# Altium schematic sheet K210_V1.SchDoc
size A2
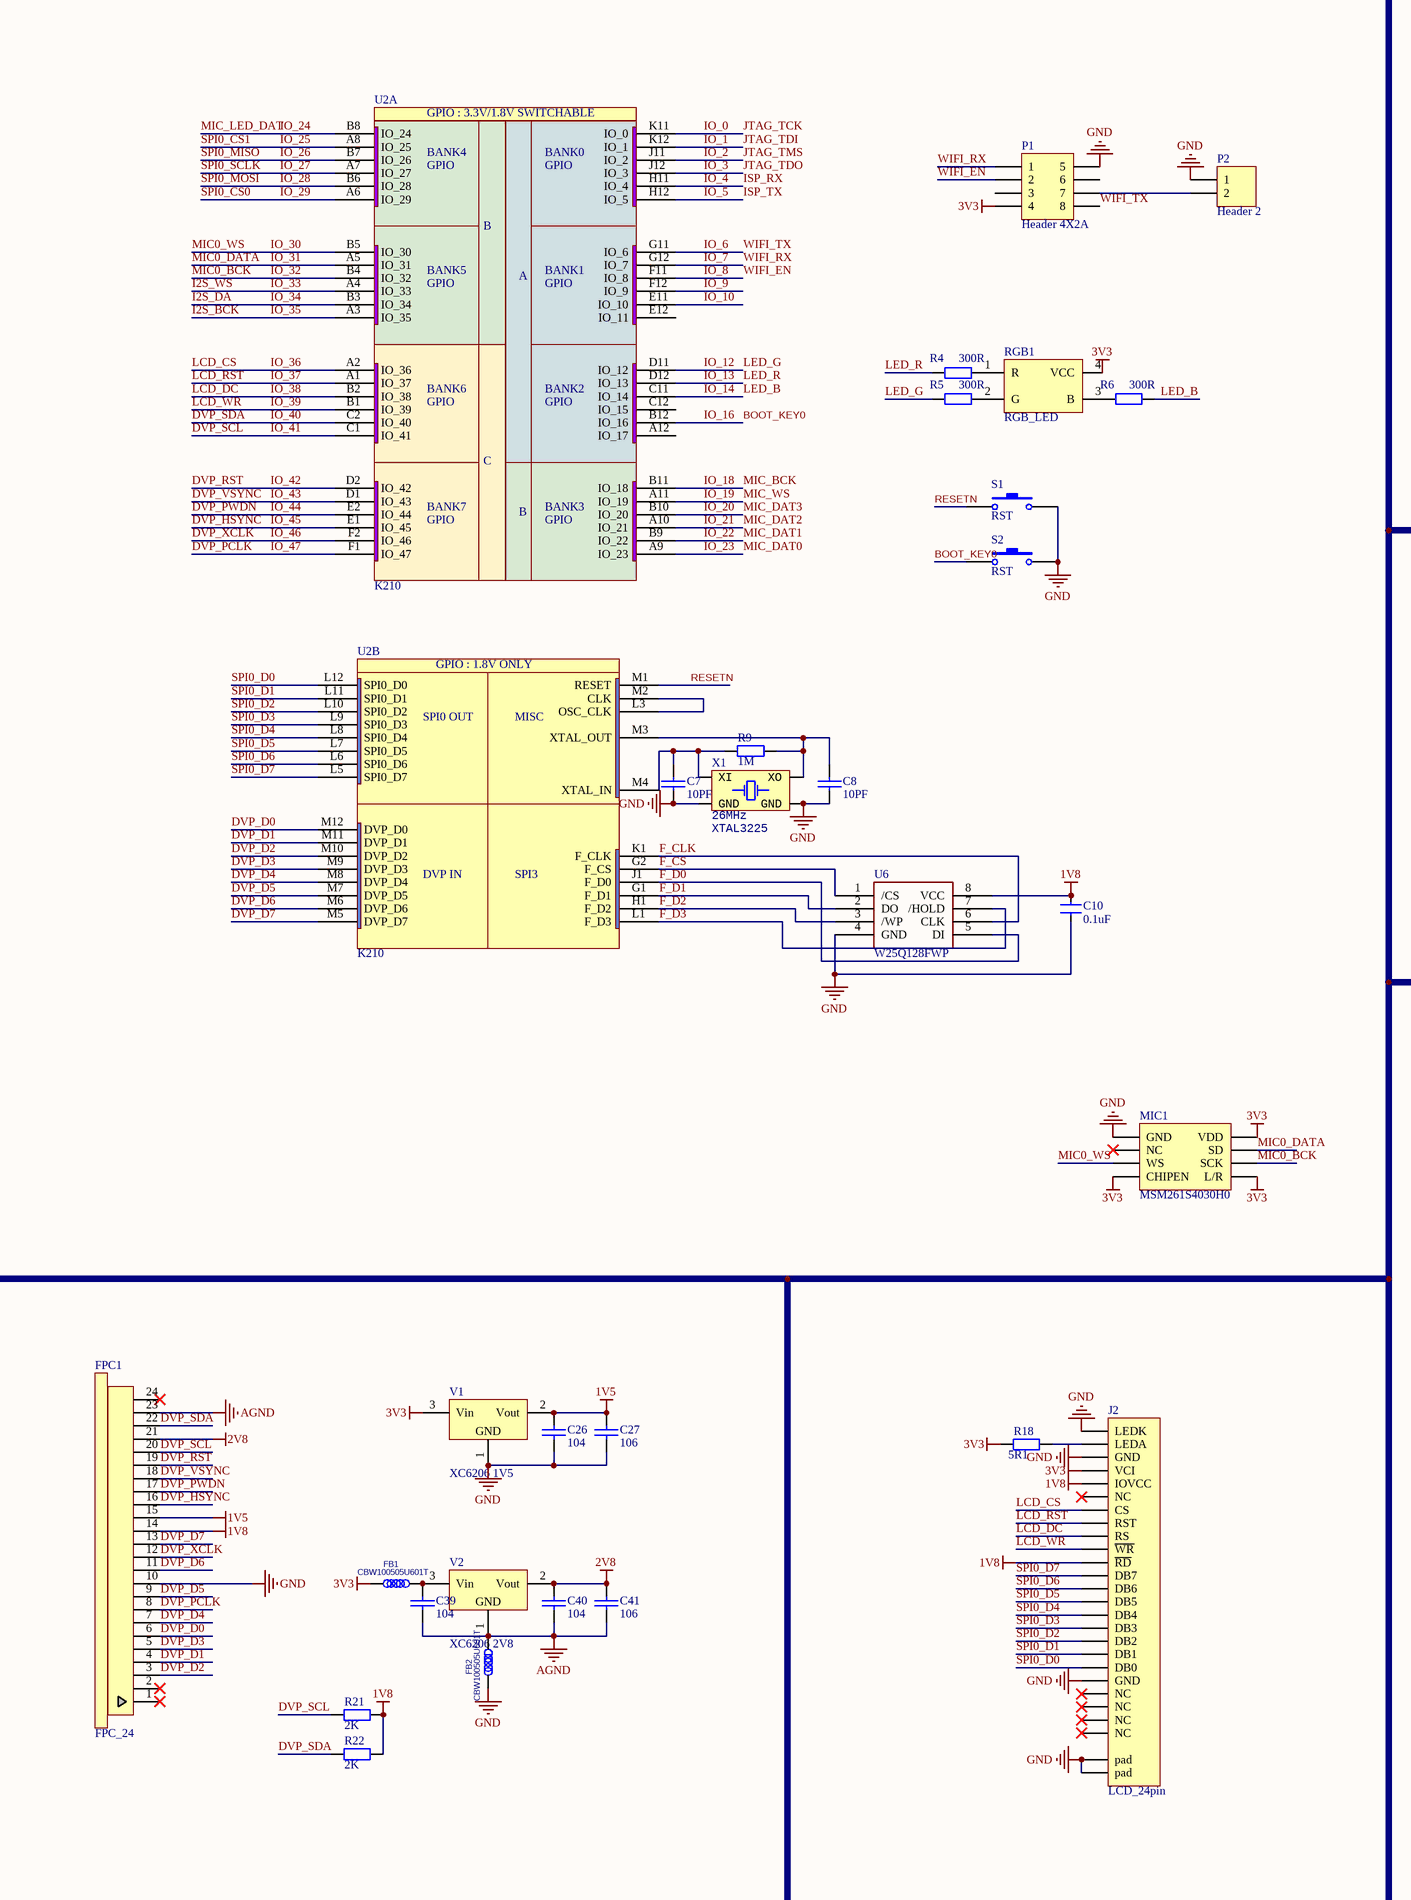
[diagram p0: K210_V1.SchDoc, left]
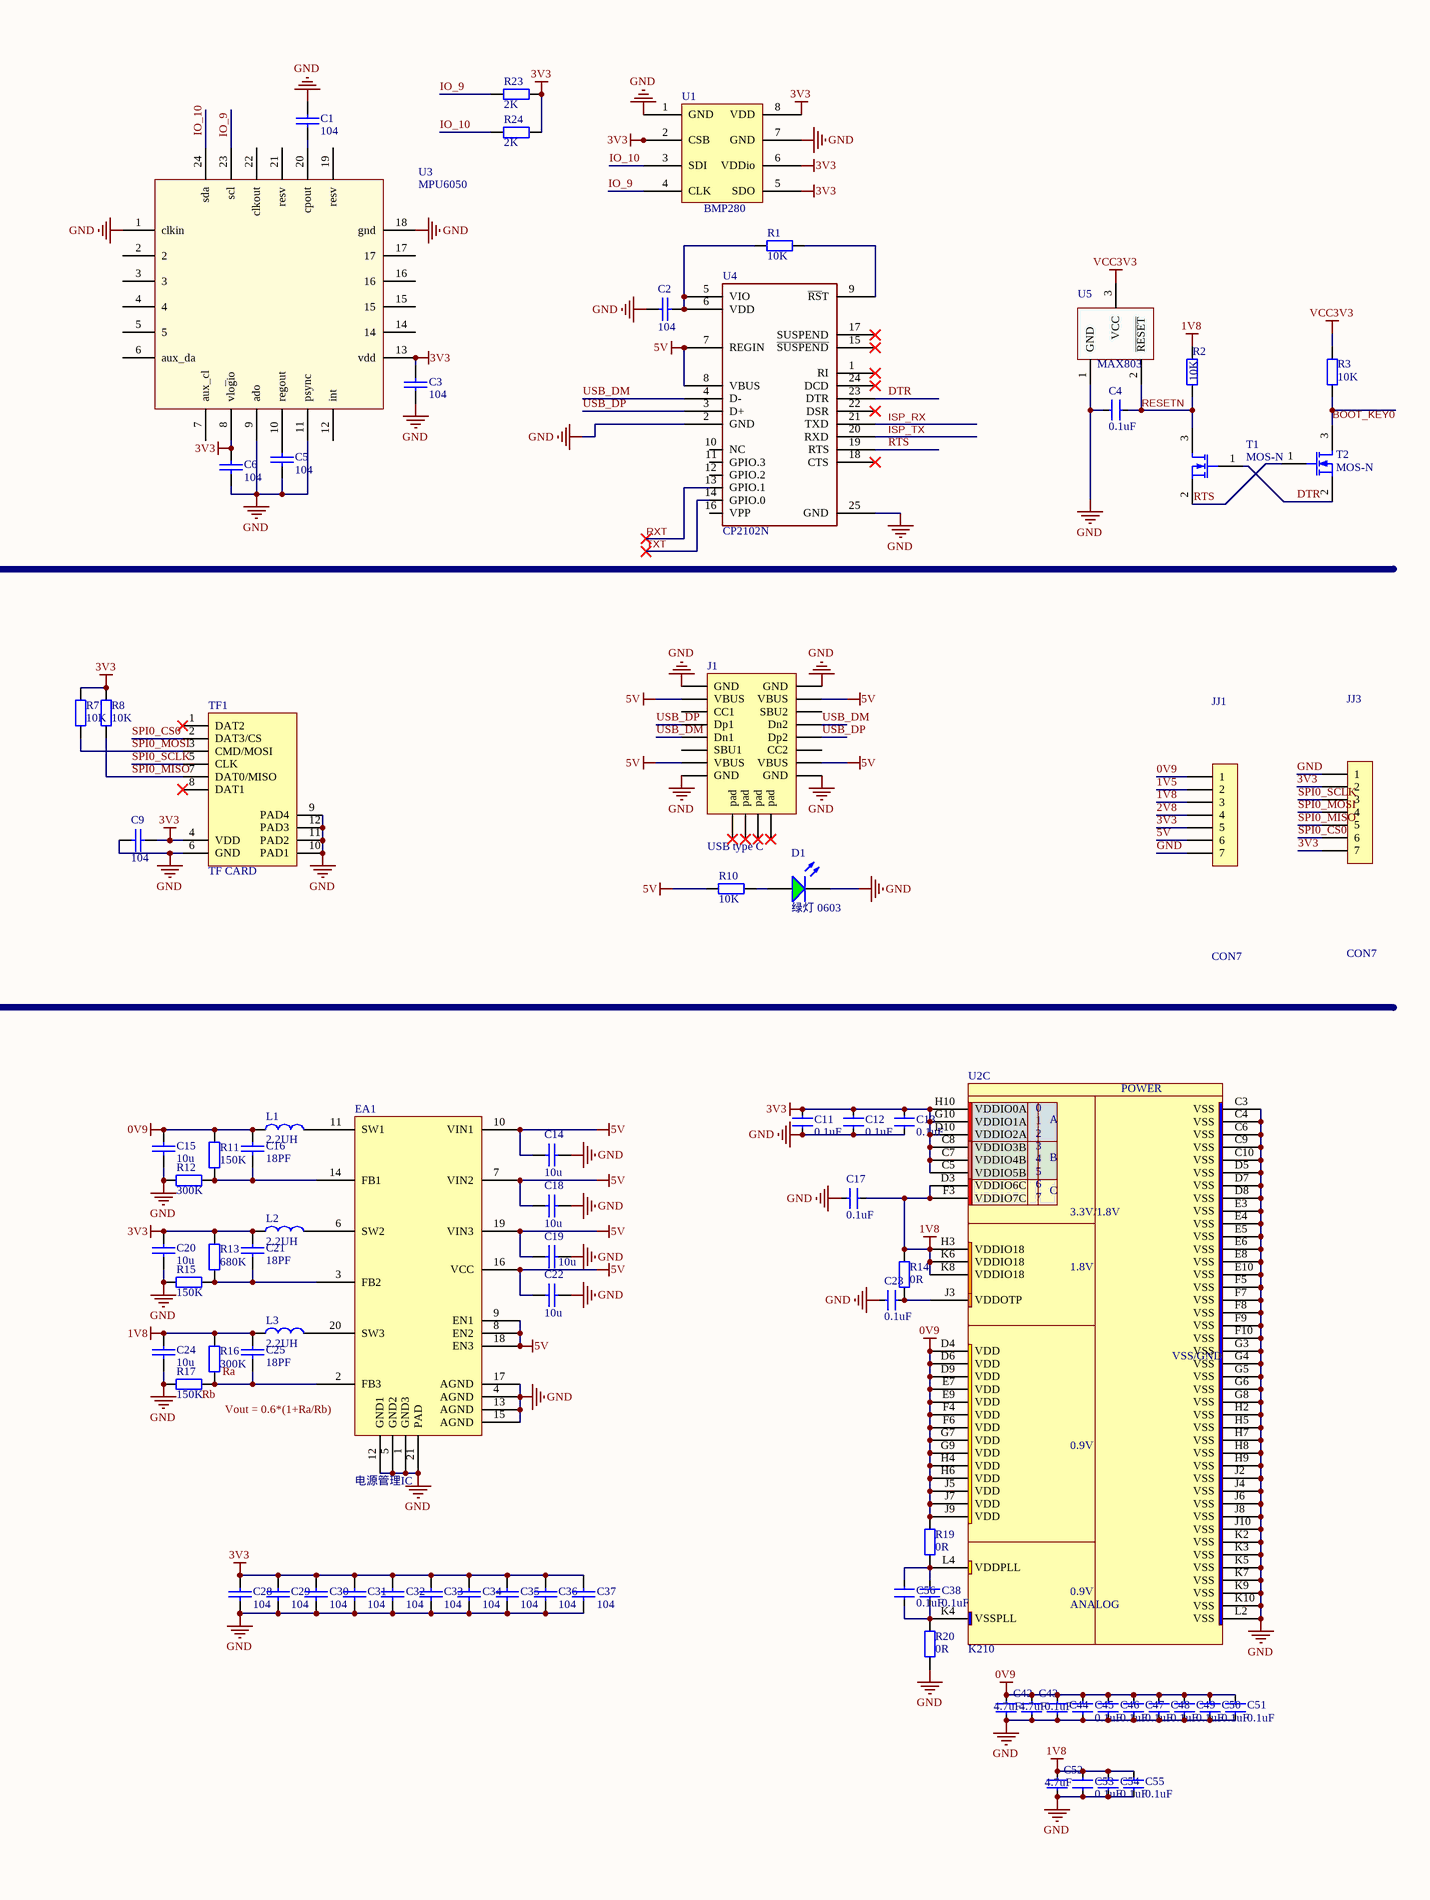
[diagram p1: K210_V1.SchDoc, right]

## Parts
C1  104  [0603_C]
C2  104  [0603_C]
C3  104  [0603_C]
C4  0.1uF  [0603_C]
C5  104  [0603_C]
C6  104  [0603_C]
C7  10PF  [0603_C]
C8  10PF  [0603_C]
C9  104  [0603_C]
C10  0.1uF  [0603_C]
C11  0.1uF  [0603_C]
C12  0.1uF  [0603_C]
C13  0.1uF  [0603_C]
C14  10u  [0603_C]
C15  10u  [0603_C]
C16  18PF  [0603_C]
C17  0.1uF  [0603_C]
C18  10u  [0603_C]
C19  10u  [0603_C]
C20  10u  [0603_C]
C21  18PF  [0603_C]
C22  10u  [0603_C]
C23  0.1uF  [0603_C]
C24  10u  [0603_C]
C25  18PF  [0603_C]
C26  104  [0603_C]
C27  106  [0603_C]
C28  104  [0603_C]
C29  104  [0603_C]
C30  104  [0603_C]
C31  104  [0603_C]
C32  104  [0603_C]
C33  104  [0603_C]
C34  104  [0603_C]
C35  104  [0603_C]
C36  104  [0603_C]
C37  104  [0603_C]
C38  0.1uF  [0603_C]
C39  104  [0603_C]
C40  104  [0603_C]
C41  106  [0603_C]
C42  4.7uF  [0603_C]
C43  4.7uF  [0603_C]
C44  0.1uF  [0603_C]
C45  0.1uF  [0603_C]
C46  0.1uF  [0603_C]
C47  0.1uF  [0603_C]
C48  0.1uF  [0603_C]
C49  0.1uF  [0603_C]
C50  0.1uF  [0603_C]
C51  0.1uF  [0603_C]
C52  4.7uF  [0603_C]
C53  0.1uF  [0603_C]
C54  0.1uF  [0603_C]
C55  0.1uF  [0603_C]
C56  0.1uF  [0603_C]
D1  绿灯 0603  [0603_LED]
EA1  电源管理IC  [QFN20 3x3_M]
FB1  CBW100505U601T  [0603_R]
FB2  CBW100505U601T  [0603_R]
FPC1  FPC_24  [FPC_24]
J1  USB type C  [USB Type-C-16Pin_A]
J2  LCD_24pin  [OV7740]
JJ1  CON7  [HDR2.54-LI-7P]
JJ3  CON7  [HDR2.54-LI-7P]
L1  2.2UH  [NR3015]
L2  2.2UH  [NR3015]
L3  2.2UH  [NR3015]
MIC1  MSM261S4030H0  [MSM261S4030H0]
P1  Header 4X2A  [HDR2X4_CEN]
P2  Header 2  [HDR1X2]
R1  10K  [0603_R]
R2  10K  [0603_R]
R3  10K  [0603_R]
R4  value 300R  [0603_R]  (hidden comment: 1K)
R5  value 300R  [0603_R]  (hidden comment: 1K)
R6  value 300R  [0603_R]  (hidden comment: 1K)
R7  value 10K  [0603_R]  (hidden comment: Res2)
R8  value 10K  [0603_R]  (hidden comment: Res2)
R9  value 1M  [0603_R]  (hidden comment: Res2)
R10  value 10K  [0603_R]  (hidden comment: Res2)
R11  value 150K  [0603_R]  (hidden comment: Res2)
R12  value 300K  [0603_R]  (hidden comment: Res2)
R13  value 680K  [0603_R]  (hidden comment: Res2)
R14  0R  [0603_R]
R15  value 150K  [0603_R]  (hidden comment: Res2)
R16  value 300K  [0603_R]  (hidden comment: Res2)
R17  value 150K  [0603_R]  (hidden comment: Res2)
R18  value 5R1  [0603_R]  (hidden comment: Res2)
R19  0R  [0603_R]
R20  0R  [0603_R]
R21  value 2K  [0603_R]  (hidden comment: Res2)
R22  value 2K  [0603_R]  (hidden comment: Res2)
R23  value 2K  [0603_R]  (hidden comment: Res2)
R24  value 2K  [0603_R]  (hidden comment: Res2)
RGB1  RGB_LED  [LED_3528_RGB]
S1  RST  [KEY_1]
S2  RST  [KEY_1]
T1  MOS-N  [SOT23-3N]
T2  MOS-N  [SOT23-3N]
TF1  TF CARD  [TF卡座]
U1  BMP280  [BMP280]
U2  K210  [BGA144C65P12X12_800X800X95]  (parts A,B,C of 3)
U3  MPU6050  [QFN24 4x4_M]
U4  CP2102N  [QFN24 4x4_N]
U5  MAX803  [SOT23-3N]
U6  W25Q128FWP  [WSON8]
V1  XC6206 1V5  [SOT23-3N]
V2  XC6206 2V8  [SOT23-3N]
X1  Type: XTAL3225  [XT_3225_4]  (hidden comment: 26MHz)

## Nets
0V9: C15.1 C16.1 C42.2 C43.2 C44.2 C45.2 C46.2 C47.2 C48.2 C49.2 C50.2 C51.2 JJ1.1 L1.2 R11.2 R19.2 U2.D4(VDD) U2.D6(VDD) U2.D9(VDD) U2.E7(VDD) U2.E9(VDD) U2.F4(VDD) U2.F6(VDD) U2.G7(VDD) U2.G9(VDD) U2.H4(VDD) U2.H6(VDD) U2.J5(VDD) U2.J7(VDD) U2.J9(VDD)
1V5: C26.1 C27.1 FPC1.15 JJ1.2 V1.2(Vout)
1V8: C10.2 C17.1 C24.1 C25.1 C52.2 C53.2 C54.2 C55.2 FPC1.14 J2.5(IOVCC) J2.11(~{RD}) JJ1.3 L3.2 R2.2 R14.1 R16.2 R21.1 R22.1 U2.D3(VDDIO6C) U2.F3(VDDIO7C) U2.H3(VDDIO18) U2.K6(VDDIO18) U2.K8(VDDIO18) U6.8(VCC)
2V8: C40.1 C41.1 FPC1.21 JJ1.4 V2.2(Vout)
3V3: C3.2 C6.2 C9.2 C11.1 C12.1 C13.1 C20.1 C21.1 C28.1 C29.1 C30.1 C31.1 C32.1 C33.1 C34.1 C35.1 C36.1 C37.1 FB1.2 J2.4(VCI) JJ1.5 JJ3.2 JJ3.7 L2.2 MIC1.4(CHIPEN) MIC1.5(L/R) MIC1.8(VDD) P1.4 R7.1 R8.1 R13.2 R18.2 R23.1 R24.1 RGB1.4(VCC) TF1.4(VDD) U1.2(CSB) U1.5(SDO) U1.6(VDDio) U1.8(VDD) U2.C5(VDDIO5B) U2.C7(VDDIO4B) U2.C8(VDDIO3B) U2.D10(VDDIO2A) U2.G10(VDDIO1A) U2.H10(VDDIO0A) U3.8(vlo~{g}io) U3.13(vdd) V1.3(Vin)
5V: C14.1 C18.1 C19.1 C22.1 EA1.7(VIN2) EA1.8(EN2) EA1.9(EN1) EA1.10(VIN1) EA1.16(VCC) EA1.18(EN3) EA1.19(VIN3) J1.A4(VBUS) J1.A9(VBUS) J1.B4(VBUS) J1.B9(VBUS) JJ1.6 R10.1 U4.7(REGIN) U4.8(VBUS)
AGND: C39.2 C40.2 C41.2 FB2.1 FPC1.23 V2.1(GND)
GND: C1.2 C2.2 C3.1 C4.1 C5.1 C6.1 C7.2 C8.2 C9.1 C10.1 C11.2 C12.2 C13.2 C14.2 C15.2 C17.2 C18.2 C19.2 C20.2 C22.2 C23.1 C24.2 C26.2 C27.2 C28.2 C29.2 C30.2 C31.2 C32.2 C33.2 C34.2 C35.2 C36.2 C37.2 C42.1 C43.1 C44.1 C45.1 C46.1 C47.1 C48.1 C49.1 C50.1 C51.1 C52.1 C53.1 C54.1 C55.1 D1.K EA1.1(GND3) EA1.4(AGND) EA1.5(GND2) EA1.12(GND1) EA1.13(AGND) EA1.15(AGND) EA1.17(AGND) EA1.21(PAD) FB2.2 FPC1.10 J1.A1(GND) J1.A12(GND) J1.B1(GND) J1.B12(GND) J2.1(LEDK) J2.3(GND) J2.20(GND) J2.25(pad) J2.26(pad) JJ1.7 JJ3.1 MIC1.1(GND) P1.5 P2.1 R12.1 R15.1 R17.1 R20.1 S1.2 S2.2 TF1.6(GND) TF1.9(PAD4) TF1.10(PAD1) TF1.11(PAD2) TF1.12(PAD3) U1.1(GND) U1.7(GND) U2.C3(VSS) U2.C4(VSS) U2.C6(VSS) U2.C9(VSS) U2.C10(VSS) U2.D5(VSS) U2.D7(VSS) U2.D8(VSS) U2.E3(VSS) U2.E4(VSS) U2.E5(VSS) U2.E6(VSS) U2.E8(VSS) U2.E10(VSS) U2.F5(VSS) U2.F7(VSS) U2.F8(VSS) U2.F9(VSS) U2.F10(VSS) U2.G3(VSS) U2.G4(VSS) U2.G5(VSS) U2.G6(VSS) U2.G8(VSS) U2.H2(VSS) U2.H5(VSS) U2.H7(VSS) U2.H8(VSS) U2.H9(VSS) U2.J2(VSS) U2.J4(VSS) U2.J6(VSS) U2.J8(VSS) U2.J10(VSS) U2.K2(VSS) U2.K3(VSS) U2.K5(VSS) U2.K7(VSS) U2.K9(VSS) U2.K10(VSS) U2.L2(VSS) U3.1(clkin) U3.9(ado) U3.11(psync) U3.18(gnd) U4.2(GND) U4.25(GND) U5.1(GND) U6.4(GND) V1.1(GND) X1.2(GND) X1.4(GND)
VCC3V3: R3.1 U5.3(VCC)
BOOT_KEY0: R3.2 S2.1 T2.3 U2.B12(IO_16)  [also labelled IO_16]
DTR: T1.1 T2.2 U4.23(DTR)
DVP_D0: FPC1.6 U2.M12(DVP_D0)
DVP_D1: FPC1.4 U2.M11(DVP_D1)
DVP_D2: FPC1.3 U2.M10(DVP_D2)
DVP_D3: FPC1.5 U2.M9(DVP_D3)
DVP_D4: FPC1.7 U2.M8(DVP_D4)
DVP_D5: FPC1.9 U2.M7(DVP_D5)
DVP_D6: FPC1.11 U2.M6(DVP_D6)
DVP_D7: FPC1.13 U2.M5(DVP_D7)
DVP_HSYNC: FPC1.16 U2.E1(IO_45)  [also labelled IO_45]
DVP_PCLK: FPC1.8 U2.F1(IO_47)  [also labelled IO_47]
DVP_PWDN: FPC1.17 U2.E2(IO_44)  [also labelled IO_44]
DVP_RST: FPC1.19 U2.D2(IO_42)  [also labelled IO_42]
DVP_SCL: FPC1.20 R21.2 U2.C1(IO_41)  [also labelled IO_41]
DVP_SDA: FPC1.22 R22.2 U2.C2(IO_40)  [also labelled IO_40]
DVP_VSYNC: FPC1.18 U2.D1(IO_43)  [also labelled IO_43]
DVP_XCLK: FPC1.12 U2.F2(IO_46)  [also labelled IO_46]
F_CLK: U2.K1(F_CLK) U6.6(CLK)
F_CS: U2.G2(F_CS) U6.1(/CS)
F_D0: U2.J1(F_D0) U6.5(DI)
F_D1: U2.G1(F_D1) U6.2(DO)
F_D2: U2.H1(F_D2) U6.3(/WP)
F_D3: U2.L1(F_D3) U6.7(/HOLD)
I2S_BCK: U2.A3(IO_35)  [also labelled IO_35]
I2S_DA: U2.B3(IO_34)  [also labelled IO_34]
I2S_WS: U2.A4(IO_33)  [also labelled IO_33]
IO_0: U2.K11(IO_0)  [also labelled JTAG_TCK]
IO_1: U2.K12(IO_1)  [also labelled JTAG_TDI]
IO_2: U2.J11(IO_2)  [also labelled JTAG_TMS]
IO_3: U2.J12(IO_3)  [also labelled JTAG_TDO]
IO_4: U2.H11(IO_4) U4.21(TXD)  [also labelled ISP_RX]
IO_5: U2.H12(IO_5) U4.20(RXD)  [also labelled ISP_TX]
IO_6: P1.8 U2.G11(IO_6)  [also labelled WIFI_TX]
IO_7: P1.1 U2.G12(IO_7)  [also labelled WIFI_RX]
IO_8: P1.2 U2.F11(IO_8)  [also labelled WIFI_EN]
IO_9: R23.2 U1.4(CLK) U2.F12(IO_9) U3.23(scl)
IO_10: R24.2 U1.3(SDI) U2.E11(IO_10) U3.24(sda)
IO_12: R5.1 U2.D11(IO_12)  [also labelled LED_G]
IO_13: R4.1 U2.D12(IO_13)  [also labelled LED_R]
IO_14: R6.2 U2.C11(IO_14)  [also labelled LED_B]
IO_18: U2.B11(IO_18)  [also labelled MIC_BCK]
IO_19: U2.A11(IO_19)  [also labelled MIC_WS]
IO_20: U2.B10(IO_20)  [also labelled MIC_DAT3]
IO_21: U2.A10(IO_21)  [also labelled MIC_DAT2]
IO_22: U2.B9(IO_22)  [also labelled MIC_DAT1]
IO_23: U2.A9(IO_23)  [also labelled MIC_DAT0]
IO_24: U2.B8(IO_24)  [also labelled MIC_LED_DAT]
IO_25: U2.A8(IO_25)  [also labelled SPI0_CS1]
IO_26: JJ3.5 R8.2 TF1.7(DAT0/MISO) U2.B7(IO_26)  [also labelled SPI0_MISO]
IO_27: JJ3.3 TF1.5(CLK) U2.A7(IO_27)  [also labelled SPI0_SCLK]
IO_28: JJ3.4 R7.2 TF1.3(CMD/MOSI) U2.B6(IO_28)  [also labelled SPI0_MOSI]
IO_29: JJ3.6 TF1.2(DAT3/CS) U2.A6(IO_29)  [also labelled SPI0_CS0]
IO_30: MIC1.3(WS) U2.B5(IO_30)  [also labelled MIC0_WS]
IO_31: MIC1.7(SD) U2.A5(IO_31)  [also labelled MIC0_DATA]
IO_32: MIC1.6(SCK) U2.B4(IO_32)  [also labelled MIC0_BCK]
IO_36: J2.7(CS) U2.A2(IO_36)  [also labelled LCD_CS]
IO_37: J2.8(RST) U2.A1(IO_37)  [also labelled LCD_RST]
IO_38: J2.9(RS) U2.B2(IO_38)  [also labelled LCD_DC]
IO_39: J2.10(~{WR}) U2.B1(IO_39)  [also labelled LCD_WR]
RESETN: C4.2 R2.1 S1.1 T1.3 U2.M1(RESET) U5.2(~{RESET})
RTS: T1.2 T2.1 U4.19(RTS)
RXT: U4.13(GPIO.1)
SPI0_D0: J2.19(DB0) U2.L12(SPI0_D0)
SPI0_D1: J2.18(DB1) U2.L11(SPI0_D1)
SPI0_D2: J2.17(DB2) U2.L10(SPI0_D2)
SPI0_D3: J2.16(DB3) U2.L9(SPI0_D3)
SPI0_D4: J2.15(DB4) U2.L8(SPI0_D4)
SPI0_D5: J2.14(DB5) U2.L7(SPI0_D5)
SPI0_D6: J2.13(DB6) U2.L6(SPI0_D6)
SPI0_D7: J2.12(DB7) U2.L5(SPI0_D7)
TXT: U4.14(GPIO.0)
USB_DM: J1.A7(Dn1) J1.B7(Dn2) U4.4(D-)
USB_DP: J1.A6(Dp1) J1.B6(Dp2) U4.3(D+)
NetC1_1: C1.1 U3.20(cpout)
NetC2_1: C2.1 R1.2 U4.5(VIO) U4.6(VDD)
NetC5_2: C5.2 U3.10(regout)
NetC7_1: C7.1 R9.2 U2.M4(XTAL_IN) X1.1(XI)
NetC8_1: C8.1 R9.1 U2.M3(XTAL_OUT) X1.3(XO)
NetC16_2: C16.2 EA1.14(FB1) R11.1 R12.2
NetC21_2: C21.2 EA1.3(FB2) R13.1 R15.2
NetC23_2: C23.2 R14.2 U2.J3(VDDOTP)
NetC25_2: C25.2 EA1.2(FB3) R16.1 R17.2
NetC38_1: C38.1 C56.1 R20.2 U2.K4(VSSPLL)
NetC38_2: C38.2 C56.2 R19.1 U2.L4(VDDPLL)
NetC39_1: C39.1 FB1.1 V2.3(Vin)
NetD1_A: D1.A R10.2
NetEA1_6: EA1.6(SW2) L2.1
NetEA1_11: EA1.11(SW1) L1.1
NetEA1_20: EA1.20(SW3) L3.1
NetJ2_2: J2.2(LEDA) R18.1
NetP1_7: P1.7 P2.2
NetR1_1: R1.1 U4.9(~{RS}T)
NetR4_2: R4.2 RGB1.1(R)
NetR5_2: R5.2 RGB1.2(G)
NetR6_1: R6.1 RGB1.3(B)
NetU2_L3: U2.L3(OSC_CLK) U2.M2(CLK)

Not connected (* = marked no-connect by the designer): FPC1 1* 2* 24*; J1 0(pad)* A5(CC1) A8(SBU1) B5(CC2) B8(SBU2); J2 6(NC)* 21(NC)* 22(NC)* 23(NC)* 24(NC)*; MIC1 2(NC)*; P1 3 6; TF1 1(DAT2)* 8(DAT1)*; U2 A12(IO_17) C12(IO_15) E12(IO_11); U3 2 3 4 5 6(aux_da) 7(aux_cl) 12(int) 14 15 16 17 19(resv) 21(resv) 22(clkout); U4 1(RI)* 10(NC) 11(GPIO.3) 12(GPIO.2) 15(~{SUSPEND})* 16(VPP) 17(SUSPEND)* 18(CTS)* 22(DSR)* 24(DCD)*

## Notes on the sheet
- Labels drawn without touching a wire or pin: Ra, Rb, Vout = 0.6*(1+Ra/Rb)
- (in symbol K210, part A) GPIO : 3.3V/1.8V SWITCHABLE; BANK4; BANK0; GPIO; B; BANK5; A; BANK1; BANK6; BANK2; C; BANK7; BANK3
- (in symbol K210, part B) GPIO : 1.8V ONLY; SPI0 OUT; MISC; DVP IN; SPI3
- (in symbol K210, part C) POWER; 0; 1; A; 2; 3; 4; B; 5; 6; C; 7; 3.3V/1.8V; 1.8V; VSS/GND; 0.9V; ANALOG

## Library data of the parts
C1-C3 C5-C9 C14-C16 C18-C22 C24-C37 C39-C41 = CAP
C4 C10-C13 C17 C23 C38 C42-C56 = CAP: 普通小电容
D1 = 0603 绿灯: 发光二极管; ComponentLink1Description: 供应商链接; ComponentLink1URL: http://www.szlcsc.com/product/details_73152.html; Package: 0603; Supplier: LC; SuppliersPartNumber: C72043
EA1 = EA3036
FB1 FB2 = FB: DescriptiveText: 0402 磁珠 600R@100MHz,150mA; TYPE: 贴片磁珠
J1 = USB_C
L1-L3 = L1: 电感
P1 = Header 4X2A: Header, 4-Pin, Dual row; LatestRevisionDate: 17-Jul-2002; LatestRevisionNote: Re-released for DXP Platform.; Publisher: Altium Limited
P2 = Header 2: Header, 2-Pin; LatestRevisionDate: 17-Jul-2002; LatestRevisionNote: Re-released for DXP Platform.; Publisher: Altium Limited
R1-R3 R14 R19 R20 = RES: 普通电阻
R4-R13 R15-R18 R21-R24 = Res2: Resistor; Published: 8-Jun-2000; LatestRevisionDate: 17-Jul-2002; LatestRevisionNote: Re-released for DXP Platform.; PackageReference: AXIAL-0.4; Publisher: Altium Limited
RGB1 = RGB_LED: 三色高亮LED
S1 S2 = SW-PB: Switch; Published: 24-Mar-1999; LatestRevisionDate: 17-Jul-2002; LatestRevisionNote: Re-released for DXP Platform.; PackageReference: SPST-2; Publisher: Altium Limited; PackageDescription: Switch; 2 Leads
TF1 = SD_Card_flip
U2 = K210: Canaan Kendryte K210 AI SoC; VENDOR: CANAAN INC.
U4 = CP2104
U5 = MAX809
U6 = SPIFLASH_SOP8W
V1 V2 = XC6206P332MR: 低压差线性稳压芯片; 版权归属: 源创客; BOM名称: 低压差线性稳压芯片; 学习资源: www.ooocke.com
X1 = XTAL_3225_4P: Crystal Oscillator; Value: 26MHz